# Altium schematic sheet RFModule.SchDoc: RF module - Communication
size A4; Organization: Robocup Ulaval; DocumentNumber: 5; Revision: 1.0; SheetNumber: 5; SheetTotal: 10; Version: Gamma 1.0; Conceptor: Philippe T. Simon B. Léonard G. Alexia B-L.
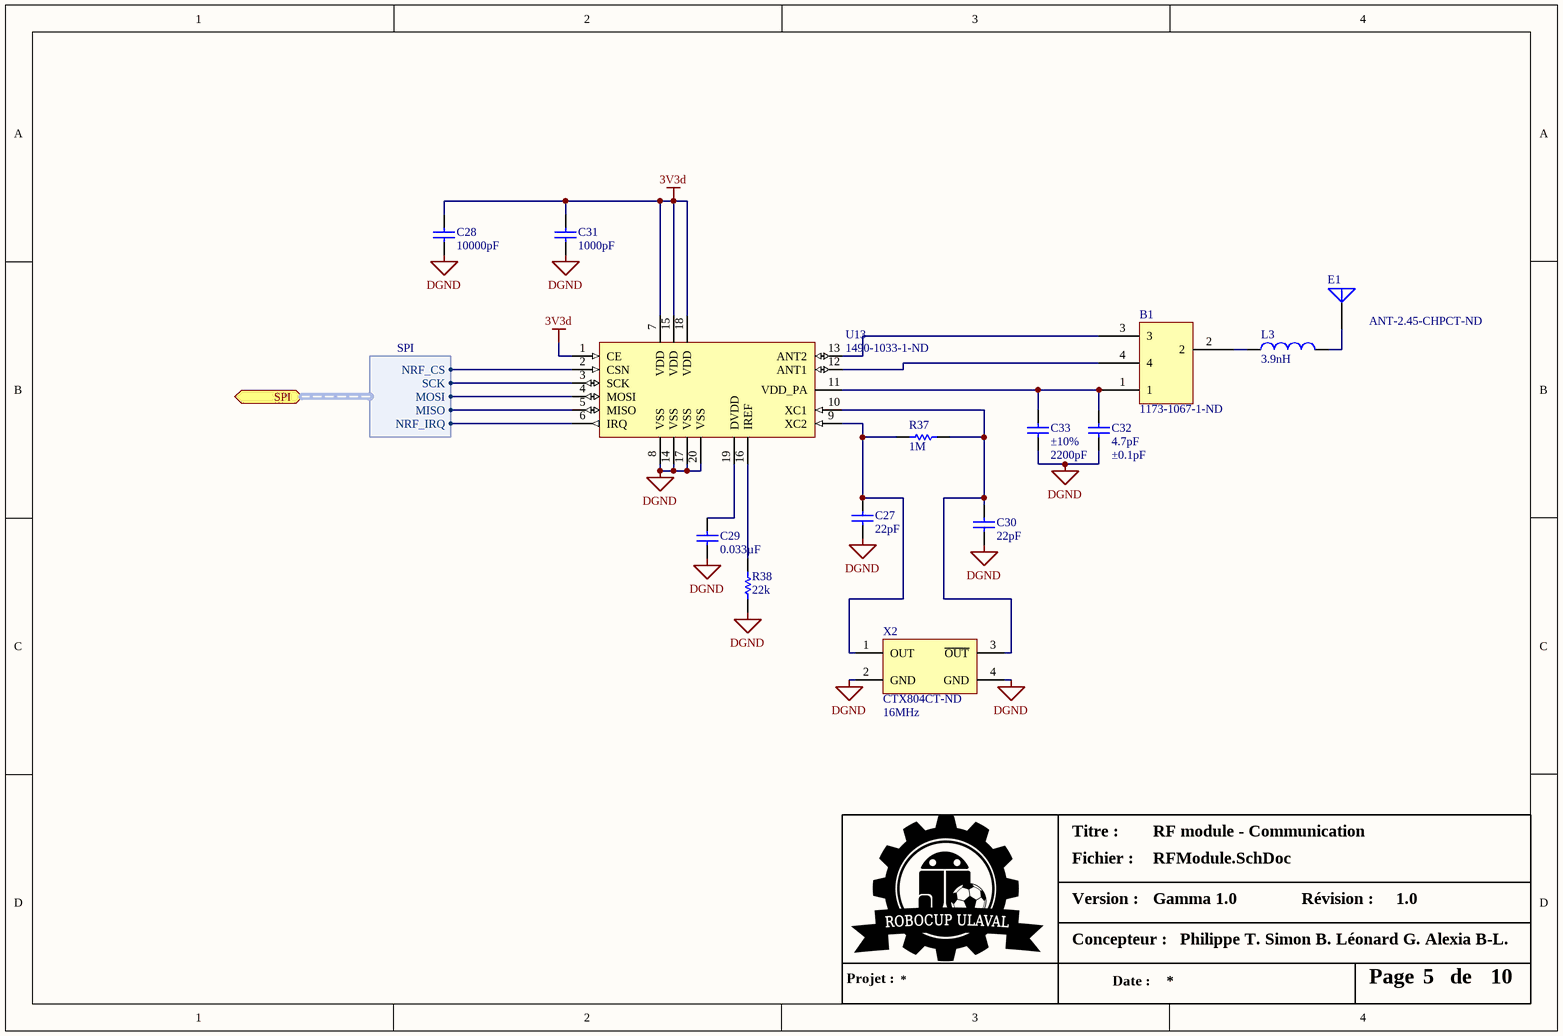
[diagram p0: RFModule.SchDoc]

## Parts
B1  Supplier Part Number 1: 1173-1067-1-ND  [BD2425NNRF]  (hidden comment: BD2425NNRF)
C27  Capacitance: 22pF  [0603]  (hidden comment: CL10C220GB8NNNC)
C28  Capacitance: 10000pF  [0603]  (hidden comment: GRM188R71H103KA01D)
C29  Capacitance: 0.033µF  [0603]  (hidden comment: CL10B333KB8SFNC)
C30  Capacitance: 22pF  [0603]  (hidden comment: CL10C220GB8NNNC)
C31  Capacitance: 1000pF  [0603]  (hidden comment: CL10B102KB8NNNC)
C32  Capacitance: 4.7pF  Tolerance: ±0.1pF  [0402]  (hidden comment: GRM1555C1E4R7BA01D)
C33  Tolerance: ±10%  Capacitance: 2200pF  [0402]  (hidden comment: GRM155R61A222KA01D)
E1  Supplier Part Number 1: ANT-2.45-CHPCT-ND  [ANT-2.45-CHP-x]  (hidden comment: ANT-2.45-CHP-T)
L3  Inductance: 3.9nH  [0402]  (hidden comment: LQP15MN3N9B02D)
R37  Resistance (Ohms): 1M  [0603]  (hidden comment: RC0603FR-071ML)
R38  Resistance (Ohms): 22k  [0603]  (hidden comment: RC0603FR-0722KL)
U13  Supplier Part Number 1: 1490-1033-1-ND  [QFN40P300X300X80_HS-21N]  (hidden comment: NRF24L01P-R7)
X2  Supplier Part Number 1: CTX804CT-ND  Frequency: 16MHz  [QFN138P200X250X65-4N]  (hidden comment: 425F35B016M0000)

## Ports
SPI (harness SPI)

## Harnesses
SPI: MISO, MOSI, NRF_CS, NRF_IRQ, SCK

## Nets
3V3d: C28.2 C31.2 U13.1(CE) U13.7(VDD) U13.15(VDD) U13.18(VDD)
DGND: C27.1 C28.1 C29.1 C30.1 C31.1 C32.1 C33.1 R38.1 U13.8(VSS) U13.14(VSS) U13.17(VSS) U13.20(VSS) X2.2(GND) X2.4(GND)
NetB1_1: B1.1 C32.2 C33.2 U13.11(VDD_PA)
NetB1_2: B1.2 L3.1
NetB1_3: B1.3 U13.13(ANT2)
NetB1_4: B1.4 U13.12(ANT1)
NetC27_2: C27.2 R37.1 U13.9(XC2) X2.1(OUT)
NetC29_2: C29.2 U13.19(DVDD)
NetC30_2: C30.2 R37.2 U13.10(XC1) X2.3(~{OUT})
NetE1_1: E1.1(A) L3.2
NetR38_2: R38.2 U13.16(IREF)
NetU13_2: U13.2(CSN) ; port SPI.NRF_CS
NetU13_3: U13.3(SCK) ; port SPI.SCK
NetU13_4: U13.4(MOSI) ; port SPI.MOSI
NetU13_5: U13.5(MISO) ; port SPI.MISO
NetU13_6: U13.6(IRQ) ; port SPI.NRF_IRQ

## Notes on the sheet
- Titre :
- Version :
- Fichier :
- Révision :
- Projet :
- Concepteur :
- Date :
- Page
- de

## Library data of the parts
B1 = BD2425NNRF: XFRMR BALUN RF 2400-2500MHZ 0404; Manufacturer: Anaren; Frequency Range: 2.4GHz ~ 2.525GHz; Impedance - Unbalanced/Balanced: 50 / - Ohm; Insertion Loss (Max): 1.25dB; Return Loss (Min): 18dB; Supplier 1: Digi-Key; Manufacturer Part Number: BD2425NNRF; RoHS: RoHS Compliant; Category: RF/IF and RFID; Stock 1: 7728; Pricing 1: 1=0.86, 10=0.838, 25=0.5604, 50=0.4992, 100=0.4572, 250=0.4102, 500=0.40166 (CAD); Packaging: Cut Tape (CT); Part Status: Active; Phase Difference: -; Package / Case: 0404 (1010 Metric); Mounting Type: Surface Mount; ComponentLink1URL: https://www.anaren.com/sites/default/files/BD2425NnRF%20Data%20Sheet%20Rev%20B_Final.pdf; ComponentLink1Description: https://www.anaren.com/sites/default/files/BD2425NnRF%20Data%20Sheet%20Rev%20B_Final.pdf
C27 C30 = CL10C220GB8NNNC: CAP CER 22PF 50V NP0 0603; Manufacturer: Samsung Electro-Mechanics America, Inc.; Tolerance: ±2%; Temperature Coefficient: C0G, NP0; Supplier 1: Digi-Key; Manufacturer Part Number: CL10C220GB8NNNC; RoHS: RoHS Compliant; Category: Capacitors; Stock 1: 20000; Pricing 1: 1=0.18, 10=0.128, 25=0.096, 50=0.0736, 100=0.0609, 500=0.04288, 1000=0.03519 (CAD); Packaging: Cut Tape (CT); Voltage - Rated: 50V; Mounting Type: Surface Mount, MLCC; Operating Temperature: -55°C ~ 125°C; Applications: General Purpose; Ratings: -; Package / Case: 0603 (1608 Metric); Size / Dimension: 0.063" L x 0.031" W (1.60mm x 0.80mm); Height - Seated (Max): -; Thickness (Max): 0.035" (0.90mm); Lead Spacing: -; Features: -; Lead Style: -; ComponentLink1URL: http://www.samsungsem.com/kr/support/product-search/mlcc/CL10C220GB8NNNC.jsp; ComponentLink1Description: http://www.samsungsem.com/kr/support/product-search/mlcc/CL10C220GB8NNNC.jsp; Supplier Part Number 1: 1276-2225-1-ND
C28 = GRM188R71H103KA01D: CAP CER 10000PF 50V X7R 0603; Manufacturer: Murata Electronics North America; Tolerance: ±10%; Supplier 1: Digi-Key; Manufacturer Part Number: GRM188R71H103KA01D; RoHS: RoHS Compliant; Category: Capacitors; Stock 1: 3064909; Pricing 1: 1=0.14, 10=0.027, 50=0.0142, 100=0.0121, 250=0.00988, 500=0.00848, 1000=0.00661 (CAD); Packaging: Cut Tape (CT); Voltage - Rated: 50V; Temperature Coefficient: X7R; Mounting Type: Surface Mount, MLCC; Operating Temperature: -55°C ~ 125°C; Applications: General Purpose; Ratings: -; Package / Case: 0603 (1608 Metric); Size / Dimension: 0.063" L x 0.031" W (1.60mm x 0.80mm); Height - Seated (Max): -; Thickness (Max): 0.035" (0.90mm); Lead Spacing: -; Features: -; Lead Style: -; ComponentLink1URL: http://www.murata.com/~/media/webrenewal/support/library/catalog/products/capacitor/mlcc/c02e.pdf; ComponentLink1Description: http://www.murata.com/~/media/webrenewal/support/library/catalog/products/capacitor/mlcc/c02e.pdf; Supplier Part Number 1: 490-1512-1-ND
C29 = CL10B333KB8SFNC: CAP CER 0.033UF 50V X7R 0603; Manufacturer: Samsung Electro-Mechanics America, Inc.; Tolerance: ±10%; Supplier 1: Digi-Key; Manufacturer Part Number: CL10B333KB8SFNC; RoHS: RoHS Compliant; Category: Capacitors; Stock 1: 125586; Pricing 1: 1=0.14, 10=0.036, 25=0.0256, 50=0.0194, 100=0.0158, 250=0.01324, 500=0.01128, 1000=0.00887 (CAD); Packaging: Cut Tape (CT); Voltage - Rated: 50V; Temperature Coefficient: X7R; Mounting Type: Surface Mount, MLCC; Operating Temperature: -55°C ~ 125°C; Applications: Boardflex Sensitive; Ratings: -; Package / Case: 0603 (1608 Metric); Size / Dimension: 0.063" L x 0.031" W (1.60mm x 0.80mm); Height - Seated (Max): -; Thickness (Max): 0.035" (0.90mm); Lead Spacing: -; Features: Soft Termination; Lead Style: -; ComponentLink1URL: http://www.samsungsem.com/kr/support/product-search/mlcc/CL10B333KB8SFNC.jsp; ComponentLink1Description: http://www.samsungsem.com/kr/support/product-search/mlcc/CL10B333KB8SFNC.jsp; Supplier Part Number 1: 1276-2042-1-ND
C31 = CL10B102KB8NNNC: CAP CER 1000PF 50V X7R 0603; Manufacturer: Samsung Electro-Mechanics America, Inc.; Tolerance: ±10%; Supplier 1: Digi-Key; Manufacturer Part Number: CL10B102KB8NNNC; RoHS: RoHS Compliant; Category: Capacitors; Stock 1: 295372; Pricing 1: 1=0.14, 10=0.024, 25=0.0172, 50=0.013, 100=0.0109, 500=0.00768, 1000=0.00597 (CAD); Packaging: Cut Tape (CT); Voltage - Rated: 50V; Temperature Coefficient: X7R; Mounting Type: Surface Mount, MLCC; Operating Temperature: -55°C ~ 125°C; Applications: General Purpose; Ratings: -; Package / Case: 0603 (1608 Metric); Size / Dimension: 0.063" L x 0.031" W (1.60mm x 0.80mm); Height - Seated (Max): -; Thickness (Max): 0.035" (0.90mm); Lead Spacing: -; Features: -; Lead Style: -; ComponentLink1URL: http://www.samsungsem.com/kr/support/product-search/mlcc/CL10B102KB8NNNC.jsp; ComponentLink1Description: http://www.samsungsem.com/kr/support/product-search/mlcc/CL10B102KB8NNNC.jsp; Supplier Part Number 1: 1276-1018-1-ND
C32 = GRM1555C1E4R7BA01D: CAP CER 4.7PF 25V NP0 0402; Manufacturer: Murata Electronics North America; Temperature Coefficient: C0G, NP0; Supplier 1: Digi-Key; Supplier Part Number 1: 490-8178-1-ND; Manufacturer Part Number: GRM1555C1E4R7BA01D; RoHS: RoHS Compliant; Category: Capacitors; Stock 1: 59490; Pricing 1: 1=0.14, 10=0.061, 50=0.033, 100=0.028, 250=0.02288, 500=0.01958, 1000=0.01526, 5000=0.01271 (CAD); Packaging: Cut Tape (CT); Part Status: Active; Voltage - Rated: 25V; Operating Temperature: -55°C ~ 125°C; Features: -; Ratings: -; Applications: General Purpose; Failure Rate: *; Mounting Type: Surface Mount, MLCC; Package / Case: 0402 (1005 Metric); Size / Dimension: 0.039" L x 0.020" W (1.00mm x 0.50mm); Height - Seated (Max): -; Thickness (Max): 0.022" (0.55mm); Lead Spacing: -; Lead Style: -; ComponentLink1URL: http://www.murata.com/~/media/webrenewal/support/library/catalog/products/capacitor/mlcc/c02e.pdf; ComponentLink1Description: http://www.murata.com/~/media/webrenewal/support/library/catalog/products/capacitor/mlcc/c02e.pdf
C33 = GRM155R61A222KA01D: CAP CER 2200PF 10V X5R 0402; Manufacturer: Murata Electronics North America; Supplier 1: Digi-Key; Supplier Part Number 1: 490-8251-1-ND; Manufacturer Part Number: GRM155R61A222KA01D; RoHS: RoHS Compliant; Category: Capacitors; Stock 1: 39963; Pricing 1: 1=0.14, 10=0.032, 50=0.0176, 100=0.0148, 250=0.01208, 500=0.01034, 1000=0.00805, 5000=0.00671 (CAD); Packaging: Cut Tape (CT); Part Status: Active; Voltage - Rated: 10V; Temperature Coefficient: X5R; Operating Temperature: -55°C ~ 85°C; Features: -; Ratings: -; Applications: General Purpose; Failure Rate: *; Mounting Type: Surface Mount, MLCC; Package / Case: 0402 (1005 Metric); Size / Dimension: 0.039" L x 0.020" W (1.00mm x 0.50mm); Height - Seated (Max): -; Thickness (Max): 0.022" (0.55mm); Lead Spacing: -; Lead Style: -; ComponentLink1URL: http://www.murata.com/~/media/webrenewal/support/library/catalog/products/capacitor/mlcc/c02e.pdf; ComponentLink1Description: http://www.murata.com/~/media/webrenewal/support/library/catalog/products/capacitor/mlcc/c02e.pdf
E1 = ANT-2.45-CHP-T: ANT 2.4GHZ 802.11 BLUETOOTH SMD; Manufacturer: Linx Technologies Inc.; Frequency Group: UHF (2 GHz ~ 3 GHz); Frequency Range: 2.36GHz ~ 2.54GHz; Antenna Type: Chip; Number of Bands: 1; VSWR: 2; Gain: 0.5dBi; Power - Max: 3W; Supplier 1: Digi-Key; Manufacturer Part Number: ANT-2.45-CHP-T; RoHS: RoHS Compliant; Category: RF/IF and RFID; Stock 1: 30000; Pricing 1: 1=4.78, 10=4.317, 25=3.8676, 100=3.4774, 250=3.08772, 500=2.69802 (CAD); Packaging: Cut Tape (CT); Frequency (Center/Band): 2.4GHz; Return Loss: -; Features: -; Termination: Solder; Ingress Protection: -; Mounting Type: Surface Mount; Height (Max): 0.002" (0.04mm); Applications: Bluetooth, WLAN, Zigbee™; ComponentLink1URL: http://www.linxtechnologies.com/resources/data-guides/ant-xxx-chp-x.pdf; ComponentLink1Description: http://www.linxtechnologies.com/resources/data-guides/ant-xxx-chp-x.pdf
L3 = LQP15MN3N9B02D: FIXED IND 3.9NH 170MA 500 MOHM; Manufacturer: Murata Electronics North America; Type: Thin Film; Material - Core: Non-Magnetic; Tolerance: ±0.1nH; Shielding: Unshielded; DC Resistance (DCR): 500 mOhm Max; Q @ Freq: 13 @ 500MHz; Frequency - Self Resonant: 6GHz; Frequency - Test: 500MHz; Supplier 1: Digi-Key; Supplier Part Number 1: 490-1131-1-ND; Manufacturer Part Number: LQP15MN3N9B02D; RoHS: RoHS Compliant; Category: Inductors, Coils, Chokes; Stock 1: 40315; Pricing 1: 1=0.25, 10=0.236, 25=0.2124, 50=0.184, 100=0.1651, 250=0.15336, 500=0.14154, 750=0.13445, 1000=0.12266 (CAD); Packaging: Cut Tape (CT); Part Status: Active; Current Rating: 170mA; Current - Saturation: -; Ratings: -; Operating Temperature: -40°C ~ 85°C; Mounting Type: Surface Mount; Package / Case: 0402 (1005 Metric); Size / Dimension: 0.039" L x 0.020" W (1.00mm x 0.50mm); Height - Seated (Max): 0.018" (0.45mm); ComponentLink1URL: http://search.murata.co.jp/Ceramy/image/img/PDF/ENG/L0075S0084LQP15M.pdf; ComponentLink1Description: http://search.murata.co.jp/Ceramy/image/img/PDF/ENG/L0075S0084LQP15M.pdf
R37 = RC0603FR-071ML: RES SMD 1M OHM 1% 1/10W 0603; Manufacturer: Yageo; Power (Watts): 0.1W, 1/10W; Temperature Coefficient: ±100ppm/°C; Supplier 1: Digi-Key; Manufacturer Part Number: RC0603FR-071ML; RoHS: RoHS Compliant; Category: Resistors; Stock 1: 1571699; Pricing 1: 1=0.15, 10=0.021, 25=0.0152, 100=0.0086, 250=0.0066, 500=0.00526, 1000=0.00389, 2500=0.00337 (CAD); Packaging: Cut Tape (CT); Tolerance: ±1%; Composition: Thick Film; Features: Moisture Resistant; Operating Temperature: -55°C ~ 155°C; Package / Case: 0603 (1608 Metric); Supplier Device Package: 0603; Size / Dimension: 0.063" L x 0.031" W (1.60mm x 0.80mm); Height: 0.022" (0.55mm); Number of Terminations: 2; ComponentLink1URL: http://www.yageo.com/documents/recent/PYu-RC_Group_51_RoHS_L_04.pdf; ComponentLink1Description: http://www.yageo.com/documents/recent/PYu-RC_Group_51_RoHS_L_04.pdf; Supplier Part Number 1: 311-1.00MHRCT-ND
R38 = RC0603FR-0722KL: RES SMD 22K OHM 1% 1/10W 0603; Manufacturer: Yageo; Power (Watts): 0.1W, 1/10W; Temperature Coefficient: ±100ppm/°C; Supplier 1: Digi-Key; Manufacturer Part Number: RC0603FR-0722KL; RoHS: RoHS Compliant; Category: Resistors; Stock 1: 2610640; Pricing 1: 1=0.15, 10=0.021, 25=0.0152, 100=0.0086, 250=0.0066, 500=0.00526, 1000=0.00389, 2500=0.00337 (CAD); Packaging: Cut Tape (CT); Tolerance: ±1%; Composition: Thick Film; Features: Moisture Resistant; Operating Temperature: -55°C ~ 155°C; Package / Case: 0603 (1608 Metric); Supplier Device Package: 0603; Size / Dimension: 0.063" L x 0.031" W (1.60mm x 0.80mm); Height: 0.022" (0.55mm); Number of Terminations: 2; ComponentLink1URL: http://www.yageo.com/documents/recent/PYu-RC_Group_51_RoHS_L_04.pdf; ComponentLink1Description: http://www.yageo.com/documents/recent/PYu-RC_Group_51_RoHS_L_04.pdf; Supplier Part Number 1: 311-22.0KHRCT-ND
U13 = NRF24L01P-R7: IC RF TXRX ISM>1GHZ 20-VFQFN; Manufacturer: Nordic Semiconductor ASA; RF Family/Standard: General ISM > 1GHZ; Modulation: GFSK; Frequency: 2.4GHz; Data Rate (Max): 2Mbps; Power - Output: 0dBm; Sensitivity: -94dBm; Serial Interfaces: SPI; Voltage - Supply: 1.9 V ~ 3.6 V; Current - Receiving: 12.6mA ~ 13.5mA; Current - Transmitting: 7mA ~ 11.3mA; Supplier 1: Digi-Key; Manufacturer Part Number: NRF24L01P-R7; RoHS: RoHS Compliant; Category: RF/IF and RFID; Stock 1: 9292; Pricing 1: 1=5.02, 10=4.479, 25=4.0312, 100=3.6725, 250=3.3142, 500=2.97384 (CAD); Packaging: Cut Tape (CT); Type: TxRx Only; Protocol: -; Memory Size: -; GPIO: -; Operating Temperature: -40°C ~ 85°C; Package / Case: 20-VFQFN Exposed Pad; ComponentLink1URL: http://www.nordicsemi.com/eng/content/download/2726/34069/file/nRF24L01P_Product_Specification_1_0.pdf; ComponentLink1Description: http://www.nordicsemi.com/eng/content/download/2726/34069/file/nRF24L01P_Product_Specification_1_0.pdf
X2 = 425F35B016M0000: CRYSTAL 16.0000MHZ 13PF SMD; Manufacturer: CTS-Frequency Controls; Frequency Stability: ±50ppm; Frequency Tolerance: ±30ppm; ESR (Equivalent Series Resistance): 100 Ohm; Operating Mode: Fundamental; Supplier 1: Digi-Key; Manufacturer Part Number: 425F35B016M0000; RoHS: RoHS Compliant; Category: Crystals and Oscillators; Stock 1: 2963; Pricing 1: 1=1.41, 10=1.246, 50=1.1634, 100=1.0295, 500=0.97292, 750=0.92144, 1000=0.81334 (CAD); Packaging: Cut Tape (CT); Type: MHz Crystal; Load Capacitance: 13pF; Operating Temperature: -20°C ~ 70°C; Ratings: -; Mounting Type: Surface Mount; Package / Case: 4-SMD, No Lead (DFN, LCC); Size / Dimension: 0.098" L x 0.079" W (2.50mm x 2.00mm); Height: 0.026" (0.65mm); ComponentLink1URL: http://www.ctscorp.com/wp-content/uploads/2015/11/008-0332-0_B.pdf; ComponentLink1Description: http://www.ctscorp.com/wp-content/uploads/2015/11/008-0332-0_B.pdf